# Altium schematic sheet Power.SchDoc
size A; SheetNumber: 2; SheetTotal: 5
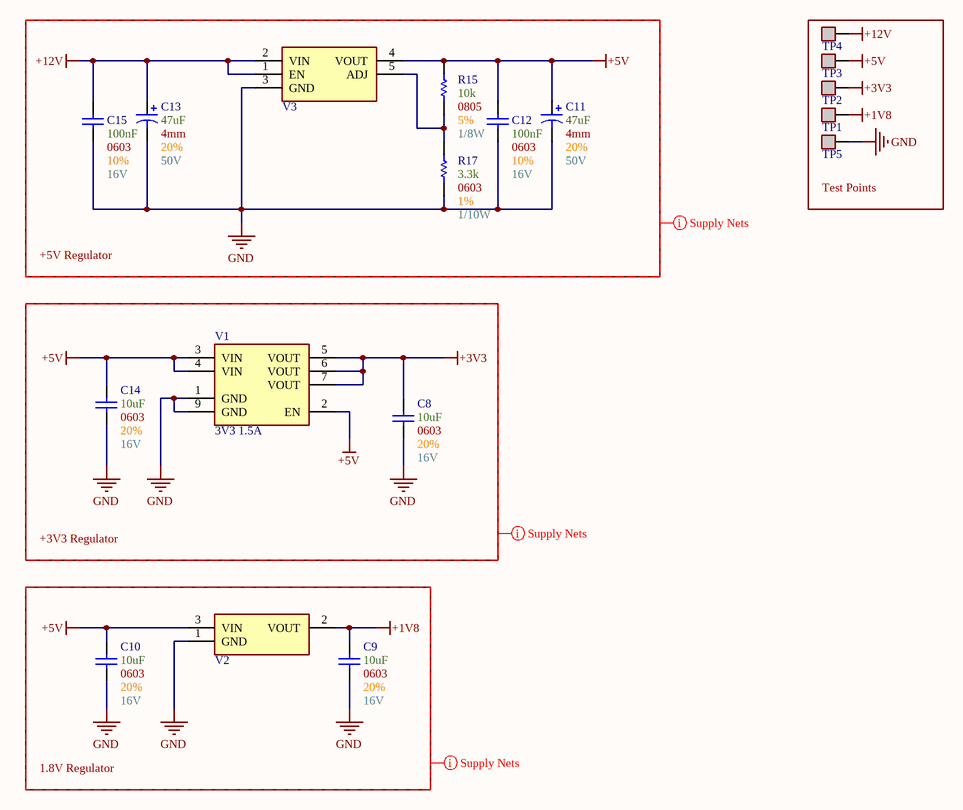
[diagram p0: Power.SchDoc]

## Parts
C8  Max Voltage: 16V  Size Package: 0603  Tolerance: 20%  Capacitance: 10uF  [[Cap] SMD 0603]  (hidden comment: [Cap] 0603 10uF 20% 16V)
C9  Max Voltage: 16V  Size Package: 0603  Tolerance: 20%  Capacitance: 10uF  [[Cap] SMD 0603]  (hidden comment: [Cap] 0603 10uF 20% 16V)
C10  Max Voltage: 16V  Size Package: 0603  Tolerance: 20%  Capacitance: 10uF  [[Cap] SMD 0603]  (hidden comment: [Cap] 0603 10uF 20% 16V)
C11  Max Voltage: 50V  Size Package: 4mm  Tolerance: 20%  Capacitance: 47uF  [[Cap] SMD Polarized, 4mm]  (hidden comment: [Cap] 4mm 47uF 20% 50V)
C12  Max Voltage: 16V  Size Package: 0603  Tolerance: 10%  Capacitance: 100nF  [[Cap] SMD 0603]  (hidden comment: [Cap] 0603 0.1uF 10% 16V)
C13  Max Voltage: 50V  Size Package: 4mm  Tolerance: 20%  Capacitance: 47uF  [[Cap] SMD Polarized, 4mm]  (hidden comment: [Cap] 4mm 47uF 20% 50V)
C14  Max Voltage: 16V  Size Package: 0603  Tolerance: 20%  Capacitance: 10uF  [[Cap] SMD 0603]  (hidden comment: [Cap] 0603 10uF 20% 16V)
C15  Max Voltage: 16V  Size Package: 0603  Tolerance: 10%  Capacitance: 100nF  [[Cap] SMD 0603]  (hidden comment: [Cap] 0603 0.1uF 10% 16V)
R15  Wattage: 1/8W  Tolerance: 5%  Resistance: 10k  Size Package: 0805  [[Res] SMD 0603]  (hidden comment: [10k] SMD 0603 1% 1/8W)
R17  Wattage: 1/10W  Tolerance: 1%  Resistance: 3.3k  Size Package: 0603  [[Res] SMD 0603]  (hidden comment: [3.3k] SMD 0603 1% 1/10W)
TP1  [THM] Thru-Hole  [[THM] White]  (value not drawn)
TP2  [THM] Thru-Hole  [[THM] White]  (value not drawn)
TP3  [THM] Thru-Hole  [[THM] White]  (value not drawn)
TP4  [THM] Thru-Hole  [[THM] White]  (value not drawn)
TP5  [THM] Thru-Hole  [[THM] White]  (value not drawn)
V1  3V3 1.5A  [[Linear] 3V3 1.5A]
V2  [Linear] 1.8V 1A  [[Linear] 1.8V 1A]  (value not drawn)
V3  [Linear] 1.25-25V 3A  [[Linear] 1.25-25V 3A]  (value not drawn)

## Blocks framed on the sheet
+5V Regulator: C11-C13 C15 R15 R17 V3
Test Points: TP1-TP5
+3V3 Regulator: C8 C14 V1
1.8V Regulator: C9 C10 V2

## Nets
+1V8: C9.2 TP1.1 V2.2(VOUT)
+3V3: C8.2 TP2.1 V1.5(VOUT) V1.6(VOUT) V1.7(VOUT)
+5V: C10.2 C11.1 C12.2 C14.2 R15.2 TP3.1 V1.2(EN) V1.3(VIN) V1.4(VIN) V2.3(VIN) V3.4(VOUT)
+12V: C13.1 C15.2 TP4.1 V3.1(EN) V3.2(VIN)
GND: C8.1 C9.1 C10.1 C11.2 C12.1 C13.2 C14.1 C15.1 R17.1 TP5.1 V1.1(GND) V1.9(GND) V2.1(GND) V3.3(GND)
NetR15_1: R15.1 R17.2 V3.5(ADJ)

## Layout directives
net class Supply_Nets: +1V8, +3V3, +5V, +12V, GND

## Library data of the parts
C8-C10 C14 = [Cap] 0603 10uF 20% 16V: GRM188C81C106MA73D; Supplier 1: DigiKey; Supplier Part Number 1: 490-7198-1-ND
C11 C13 = [Cap] 4mm 47uF 20% 50V: EEE-FN1A470UR; Supplier 1: DigiKey; Supplier Part Number 1: 10-EEE-FN1A470URCT-ND
C12 C15 = [Cap] 0603 0.1uF 10% 16V: CC0603KRX7R7BB104; Supplier 1: DigiKey; Supplier Part Number 1: 311-1088-6-ND
R15 = [10k] SMD 0603 1% 1/8W: RC0805JR-0710KL; Supplier 1: DigiKey; Supplier Part Number 1: 311-10KARCT-ND
R17 = [3.3k] SMD 0603 1% 1/10W: RC0603FR-073K3L; Supplier 1: DigiKey; Supplier Part Number 1: 311-3.30KHRCT-ND
TP1-TP5 = [THM] Thru-Hole: 5012; Supplier 1: DigiKey; Supplier Part Number 1: 36-5012-ND
V1 = [Linear] 3V3 1.5A: AP7362A-33SP-13; Supplier 1: DigiKey; Supplier Part Number 1: AP7362A-33SP-13DICT-ND
V2 = [Linear] 1.8V 1A: NCP1117IST18T3G; Supplier 1: DigiKey; Supplier Part Number 1: 488-NCP1117IST18T3GCT-ND
V3 = [Linear] 1.25-25V 3A: MIC29302WT; Supplier 1: DigiKey; Supplier Part Number 1: 576-1124-ND